# Altium schematic sheet RADAR_IO.SchDoc
size A; SheetNumber: 5; SheetTotal: 5
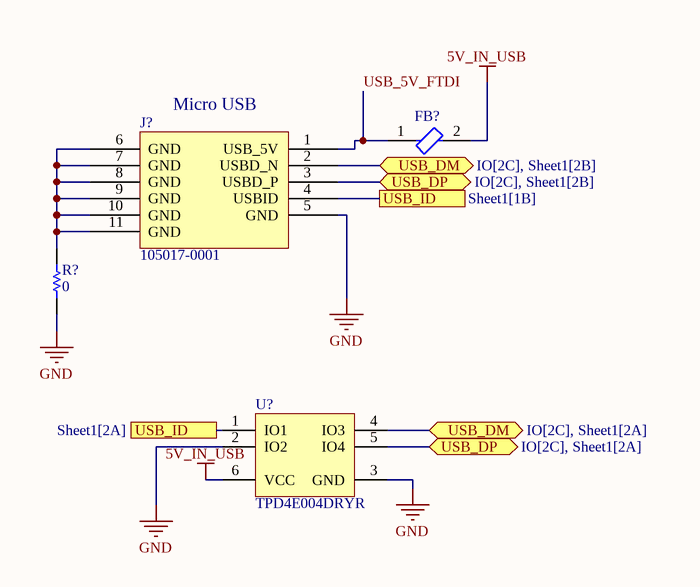
[diagram p0: RADAR_IO.SchDoc]

## Parts
FB?  BLM18AG601SN1D  [FP-BLM18-0_15-t0_8-MFG]  (value not drawn)
J?  105017-0001
R?  0  [RESC1005X40X25LL05T05]
U?  TPD4E004DRYR  [DRY0006A]

## Ports
USB_DM (bidir, see IO[2C], Sheet1[2A]), USB_DM (bidir, see IO[2C], Sheet1[2B]), USB_DP (bidir, see IO[2C], Sheet1[2A]), USB_DP (bidir, see IO[2C], Sheet1[2B]), USB_ID (see Sheet1[1B]), USB_ID (see Sheet1[2A])

## Nets
5V_IN_USB: FB?.2 U?.6(VCC)
GND: J?.5(GND) R?.1 U?.2(IO2) U?.3(GND)
USB_5V_FTDI: FB?.1 J?.1(USB_5V)
USB_DM: J?.2(USBD_N) U?.4(IO3) ; port USB_DM
USB_DP: J?.3(USBD_P) U?.5(IO4) ; port USB_DP
USB_ID: J?.4(USBID) U?.1(IO1) ; port USB_ID
NetJ?_6: J?.6(GND) J?.7(GND) J?.8(GND) J?.9(GND) J?.10(GND) J?.11(GND) R?.2

## Notes on the sheet
- (near J?) Micro USB

## Library data of the parts
FB? = CMP-0686-00436-3: Chip Ferrite Bead, 0603, 600Ω @ 100MHz, 0.38Ω, 25%, 500mA; Number of Lines: 1; Impedance: 600R; DC Resistance (DCR): 380mR; Material: Steel; Shielding: Unshielded; Max DC Current: 500mA; Termination: SMD/SMT; Military Standard: Not; Number of Circuits: 1; Min Operating Temperature: -55°C; Case Code (Imperial): 0603; Width: 0.8mm; Current Rating: 500mA; Lead Free: Lead Free; Packaging: Tape and Reel; Frequency: 100MHz; Max Operating Temperature: 125°C; DC Current: 500mA; REACH SVHC: No SVHC; Case/Package: 0603; Package Quantity: 1; Height: 0.8mm; Number of Pins: 2; Depth: 0.8mm; Test Frequency: 100MHz; Case Code (Metric): 1608; Tolerance: 25%; Core Material: Ferrite; Weight: 7.1E-05oz; Max Current Rating: 500mA; Radiation Hardening: No; Length: 1.6mm; RoHS Compliant: Yes
J? = 105017-0001: Conn Micro USB 2.0 Type B RCP 5 POS 0.65mm Solder RA SMD 5 Terminal 1 Port Micro-USB T/R; Manufacturer: Molex; Manufacturer Lifecycle Status: ACTIVE; Connector Type: Receptacle, USB; Contact Resistance: 30mΩ; Current Rating: 2.5A; Dielectric Material: Liquid Crystal Polymer; Gender: Female; Insulation Resistance: 1GΩ; Max Voltage Rating (AC): 30V; Number of Circuits: 5; Number of Ports: 1; Pitch: 650µm; Plating: Gold; USB Standard: USB 2.0; Supplier: DigiKey; Supplier Part Number: WM1399CT-ND; Manufacturer Part Number: 105017-0001; RoHS: Compliant; Category: USB Connectors; Stock: 13151; Pricing: 1=0.92, 10=0.785, 25=0.7356, 50=0.7004, 100=0.667, 250=0.62516, 500=0.59532, 1000=0.56688, 2000=0.53983, 4000=0.51407, 6000=0.49957, 10000=0.4819, 14000=0.47061, 20000=0.45893 (USD); China RoHS: Compliant; Contact Gender: Female; Contact Material: Brass; Contact Plating: Gold; Country of Origin: US; Depth: 7.5mm; Features: Shielded; Halogen Free: Low Halogen; Height: 2.825mm; Housing Material: Polymer; Length: 8.2mm; Lifecycle Status: Production; Max Operating Temperature: 85°C; Min Operating Temperature: -30°C; Mounting Technology: Surface Mount; Number of Contacts: 5; Pins: 5; Number of Positions: 5; Number of Rows: 1; Number of Terminals: 5; Orientation: Right Angle; Radiation Hardening: No; REACH SVHC: Yes; Schedule B: 8536695050, 8536695050|8536695050, 8536695050|8536695050|8536695050, 8536695050|8536695050|8536695050|8536695050; Shell Finish: Tin; Shell Material: Stainless Steel; Terminal Pitch: 650µm; Termination: Solder; Voltage Rating: 30V; Voltage Rating (AC): 30V; ComponentLink1URL: https://datasheet.octopart.com:443/1050170001-Molex-datasheet-142335147.pdf?src-supplier=IHS; ComponentLink1Description: https://datasheet.octopart.com:443/1050170001-Molex-datasheet-142335147.pdf?src-supplier=IHS; ComponentLink2URL: https://datasheet.octopart.com:443/105017-0001-Molex-datasheet-14876665.pdf?src-supplier=Upverter; ComponentLink2Description: https://datasheet.octopart.com:443/105017-0001-Molex-datasheet-14876665.pdf?src-supplier=Upverter; ComponentLink3URL: https://datasheet.octopart.com:443/105017-0001-Molex-datasheet-10100431.pdf?src-supplier=Upverter; ComponentLink3Description: https://datasheet.octopart.com:443/105017-0001-Molex-datasheet-10100431.pdf?src-supplier=Upverter; ComponentLink4URL: https://datasheet.octopart.com:443/1050170001-Molex-datasheet-8355809.pdf?src-supplier=Upverter; ComponentLink4Description: https://datasheet.octopart.com:443/1050170001-Molex-datasheet-8355809.pdf?src-supplier=Upverter; ComponentLink5URL: https://sigma.octopart.com:443/120074112/technical_drawing/Molex-1050170001.pdf?src-supplier=Upverter; ComponentLink5Description: https://sigma.octopart.com:443/120074112/technical_drawing/Molex-1050170001.pdf?src-supplier=Upverter; ComponentLink6URL: https://datasheet.octopart.com:443/105017-0001-Molex-datasheet-13746511.pdf?src-supplier=Sager+Electronics; ComponentLink6Description: https://datasheet.octopart.com:443/105017-0001-Molex-datasheet-13746511.pdf?src-supplier=Sager+Electronics; ComponentLink7URL: https://datasheet.octopart.com:443/105017-0001-Molex-datasheet-154742999.pdf?src-supplier=Master+Electronics; ComponentLink7Description: https://datasheet.octopart.com:443/105017-0001-Molex-datasheet-154742999.pdf?src-supplier=Master+Electronics; ComponentLink8URL: https://datasheet.octopart.com:443/105017-0001-Molex-datasheet-77519180.pdf?src-supplier=Newark; ComponentLink8Description: https://datasheet.octopart.com:443/105017-0001-Molex-datasheet-77519180.pdf?src-supplier=Newark; ComponentLink9URL: https://datasheet.octopart.com:443/105017-0001-Molex-datasheet-66628043.pdf?src-supplier=Newark; ComponentLink9Description: https://datasheet.octopart.com:443/105017-0001-Molex-datasheet-66628043.pdf?src-supplier=Newark; ComponentLink10URL: https://datasheet.octopart.com:443/105017-0001-Molex-datasheet-32867472.pdf?src-supplier=Farnell; ComponentLink10Description: https://datasheet.octopart.com:443/105017-0001-Molex-datasheet-32867472.pdf?src-supplier=Farnell; ComponentLink11URL: https://datasheet.octopart.com:443/105017-0001-Molex-datasheet-24907595.pdf?src-supplier=Farnell; ComponentLink11Description: https://datasheet.octopart.com:443/105017-0001-Molex-datasheet-24907595.pdf?src-supplier=Farnell; ComponentLink12URL: https://datasheet.octopart.com:443/105017-0001-Molex-datasheet-140174740.pdf?src-supplier=RS+(Formerly+Allied+Electronics); ComponentLink12Description: https://datasheet.octopart.com:443/105017-0001-Molex-datasheet-140174740.pdf?src-supplier=RS+(Formerly+Allied+Electronics); ComponentLink13URL: https://datasheet.octopart.com:443/105017-0001-Molex-datasheet-120135174.pdf?src-supplier=RS+(Formerly+Allied+Electronics); ComponentLink13Description: https://datasheet.octopart.com:443/105017-0001-Molex-datasheet-120135174.pdf?src-supplier=RS+(Formerly+Allied+Electronics); ComponentLink14URL: https://datasheet.octopart.com:443/1050170001-Molex-datasheet-137316104.pdf?src-supplier=Future+Electronics; ComponentLink14Description: https://datasheet.octopart.com:443/1050170001-Molex-datasheet-137316104.pdf?src-supplier=Future+Electronics; ComponentLink15URL: https://datasheet.octopart.com:443/105017-0001-Molex-datasheet-44399914.pdf?src-supplier=Electro+Sonic; ComponentLink15Description: https://datasheet.octopart.com:443/105017-0001-Molex-datasheet-44399914.pdf?src-supplier=Electro+Sonic; ComponentLink16URL: https://datasheet.octopart.com:443/105017-0001-Molex-datasheet-41578275.pdf?src-supplier=Electro+Sonic; ComponentLink16Description: https://datasheet.octopart.com:443/105017-0001-Molex-datasheet-41578275.pdf?src-supplier=Electro+Sonic; ComponentLink17URL: https://datasheet.octopart.com:443/105017-0001-Molex-datasheet-23708332.pdf?src-supplier=Electro+Sonic; ComponentLink17Description: https://datasheet.octopart.com:443/105017-0001-Molex-datasheet-23708332.pdf?src-supplier=Electro+Sonic; ComponentLink18URL: http://sigma.octopart.com:80/16324173/rohs_statement/Molex-105017-0001.pdf?src-supplier=Compliance+Statements; ComponentLink18Description: http://sigma.octopart.com:80/16324173/rohs_statement/Molex-105017-0001.pdf?src-supplier=Compliance+Statements; ComponentLink19URL: http://sigma.octopart.com:80/reach_statement/Molex-company-74.pdf?src-supplier=Compliance+Statements; ComponentLink19Description: http://sigma.octopart.com:80/reach_statement/Molex-company-74.pdf?src-supplier=Compliance+Statements; ComponentLink20URL: http://sigma.octopart.com:80/rohs_statement/Molex-company-73.pdf?src-supplier=Compliance+Statements; ComponentLink20Description: http://sigma.octopart.com:80/rohs_statement/Molex-company-73.pdf?src-supplier=Compliance+Statements; ComponentLink21URL: http://sigma.octopart.com:80/conflict_mineral_statement/Molex-company-72.pdf?src-supplier=Compliance+Statements; ComponentLink21Description: http://sigma.octopart.com:80/conflict_mineral_statement/Molex-company-72.pdf?src-supplier=Compliance+Statements
R? = CMP-2000-07451-1: Chip Resistor, 0 Ohm, 0.1 W, -55 to 155 degC, 0402 (1005 Metric), RoHS, Tape and Reel; Manufacturer: Panasonic; Voltage Rating (DC): 50V; Temperature Coefficient: 600ppm/��C; Max Power Dissipation: 100mW; Resistance: 0mOhm; Tolerance: 5%; Number of Terminations: 2; Mount: SurfaceMount; Height: 0.35mm; Packaging: TapeandReel; Contact Plating: Tin; Manufacturer URL: http://www.panasonic.com/; Composition: ThickFilm; Max Operating Temperature: 155degC; REACH SVHC: NoSVHC; Case/Package: 0402; Package Reference: 402; Depth: 0.5mm; Package Description: 2-Pin Surface Mount Device, Body 1 x 0.5 mm; Datasheet URL: https://industrial.panasonic.com/cdbs/www-data/pdf/RDA0000/AOA0000C301.pdf; RoHSCompliant: True; Case Code (Imperial): 0402; Military Standard: Not; Min Operating Temperature: -55degC; Power Rating: 100mW; Datasheet Version: 03/2015; Length: 1mm; Case Code (Metric): 1005; Termination: SMD/SMT; Mounting Technology: SurfaceMount; Voltage Rating: 50V; Width: 0.02inch; Package Quantity: 1; Lead Free: LeadFree; Radiation Hardening: No
U? = CMP-0326-00024-3: ESD-Protection Array for High-Speed Data Interfaces, 4 Channels, -40 to +85 degC, 6-pin SON (DRY), Green (RoHS & no Sb/Br); Manufacturer: Texas Instruments; USB High Speed: TRUE; IO Capacitance(Typ)(pF): 1.6; IEC 61000-4-2 Air-Gap(+/- kV): 12; SubFamily: ESD Solution; IO Leakage Current(nA): 1; Breakdown Voltage(Min)(V): 6; IEC 61000-4-2 Contact(+/- kV): 8; ComponentLink3Description: URL Link1; ComponentLink3URL: SamplesURL:http://www.ti.com/product/tpd4e004#samples; PackageReference: DRY0006A; ComponentLink2URL: http://www.ti.com/general/docs/lit/getliterature.tsp?genericPartNumber=TPD4E004&fileType=pdf; ComponentLink2Description: Datasheet; DatasheetVersion: SLVS729A; ComponentLink1Description: Manufacturer URL; PackageDescription: 6-Pin Plastic Small Outline No-Lead, 1 x 1.45 x 0.6 mm Body, 0.5 mm Pitch; 1394 / Firewire: TRUE; Serial ATA / eSATA: TRUE; Eco-Plan: Green (RoHS & no Sb/Br); ComponentLink1URL: http://www.ti.com/; PackageVersion: revF, Dec-2011; Mounting Technology: Surface Mount; PartNumber: TPD4E004DRYR